# EAGLE design bbSch1 (EAGLE 7.2.0)
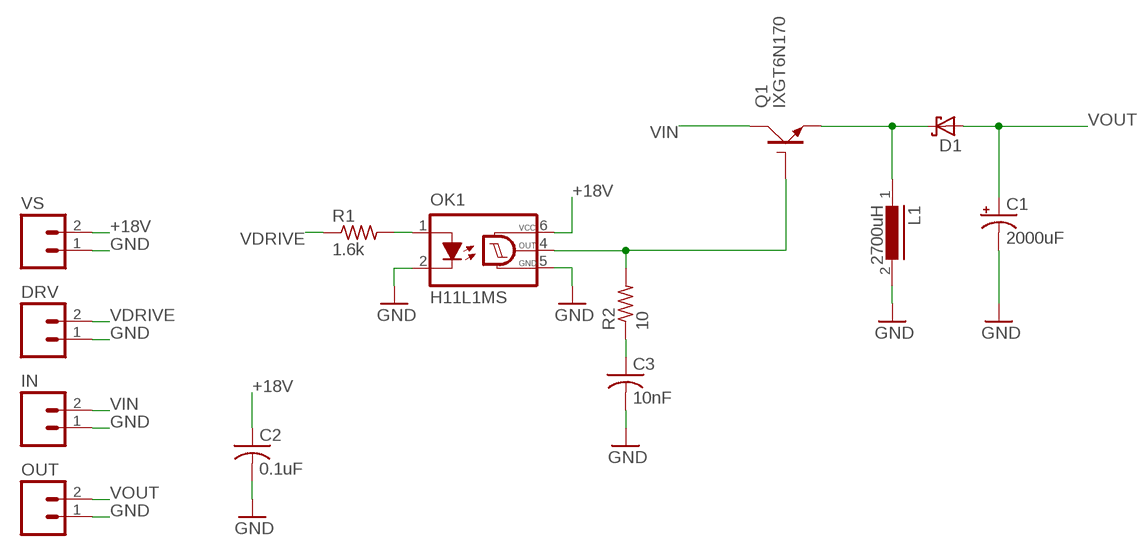
[diagram p0: schematic, sheet 1]

## Parts
C1  2000uF  CAP_POLPTH3  [CPOL-RADIAL-1000UF-63V]
C2  0.1uF  C-USC0805K  [C0805K]
C3  10nF  C-USC0805K  [C0805K]
D1  SCHOTTKY-DIODEC4111-15  [C4111-15]
DRV  M02JST-PTH-VERT  [JST-2-PTH-VERT]
IN  M02JST-PTH-VERT  [JST-2-PTH-VERT]
L1  2700uH  RKE10  [RKE10]
OK1  H11L1MS  [DIL6-SMD]
OUT  M02JST-PTH-VERT  [JST-2-PTH-VERT]
Q1  IXGT6N170  [TO268]
R1  1.6k  R-US_R0805  [R0805]
R2  10  R-US_R0805  [R0805]
VS  M02JST-PTH-VERT  [JST-2-PTH-VERT]

## Nets
+18V [MainPower]: C2.1 OK1.6(VCC) VS.2
GND [Ground]: C1.2(-) C2.2 C3.2 DRV.1 IN.1 L1.2 OK1.2(C) OK1.5(GND) OUT.1 VS.1
N$1: OK1.1(A) R1.2
N$2 [MainPower]: D1.C L1.1 Q1.E
N$4: C3.1 R2.1
VDRIVE: DRV.2 R1.1
VDRIVE18: OK1.4(OUT) Q1.G R2.2
VIN [MainPower]: IN.2 Q1.C@1(C) Q1.C@2(C)
VOUT [MainPower]: C1.1(+) D1.A OUT.2

## Library data of the parts
C1 = SparkFun-Passives:CAP_POL: Capacitor Polarized These are standard SMD and PTH capacitors. Normally 10uF, 47uF, and 100uF in electrolytic and tantalum varieties. Always verify the external diameter of the through hole cap, it varies with capacity, voltage, and manufacturer. The EIA devices should be standard.
C2 C3 = adafruit:C-US: CAPACITOR, American symbol
D1 = diodeMod:SCHOTTKY-DIODE: Schottky Diode
DRV IN OUT VS = SparkFun-Connectors:M02: Standard 2-pin 0.1" header. Use with - straight break away headers ( PRT-00116) - right angle break away headers (PRT-00553) - swiss pins (PRT-00743) - machine pins (PRT-00117) - female headers (PRT-00115) Molex polarized connector foot print use with: PRT-08233 with associated crimp pins and housings. 2.54_SCREWTERM for use with PRT-10571. 3.5mm Screw Terminal footprints for PRT-08084 5mm Screw Terminal footprints for use with PRT-08432
L1 = inductors:RKE10: INDUCTOR
OK1 = optocoupler:H11L*M: 6-Pin DIP Optocoupler Source: http://www.fairchildsemi.com/ds/H1/H11L2-M.pdf; OC_FARNELL: unknown; OC_NEWARK: unknown
Q1 = transistor-power:IXG?*N170: High Voltage IGBT Source: http://www.ixys.com/98989.pdf
R1 R2 = adafruit:R-US_: RESISTOR, American symbol

## Net classes
1 MainPower: width 2.6 mm, drill 0.4 mm
2 Ground: width 2.6 mm, drill 0.4 mm

## Board
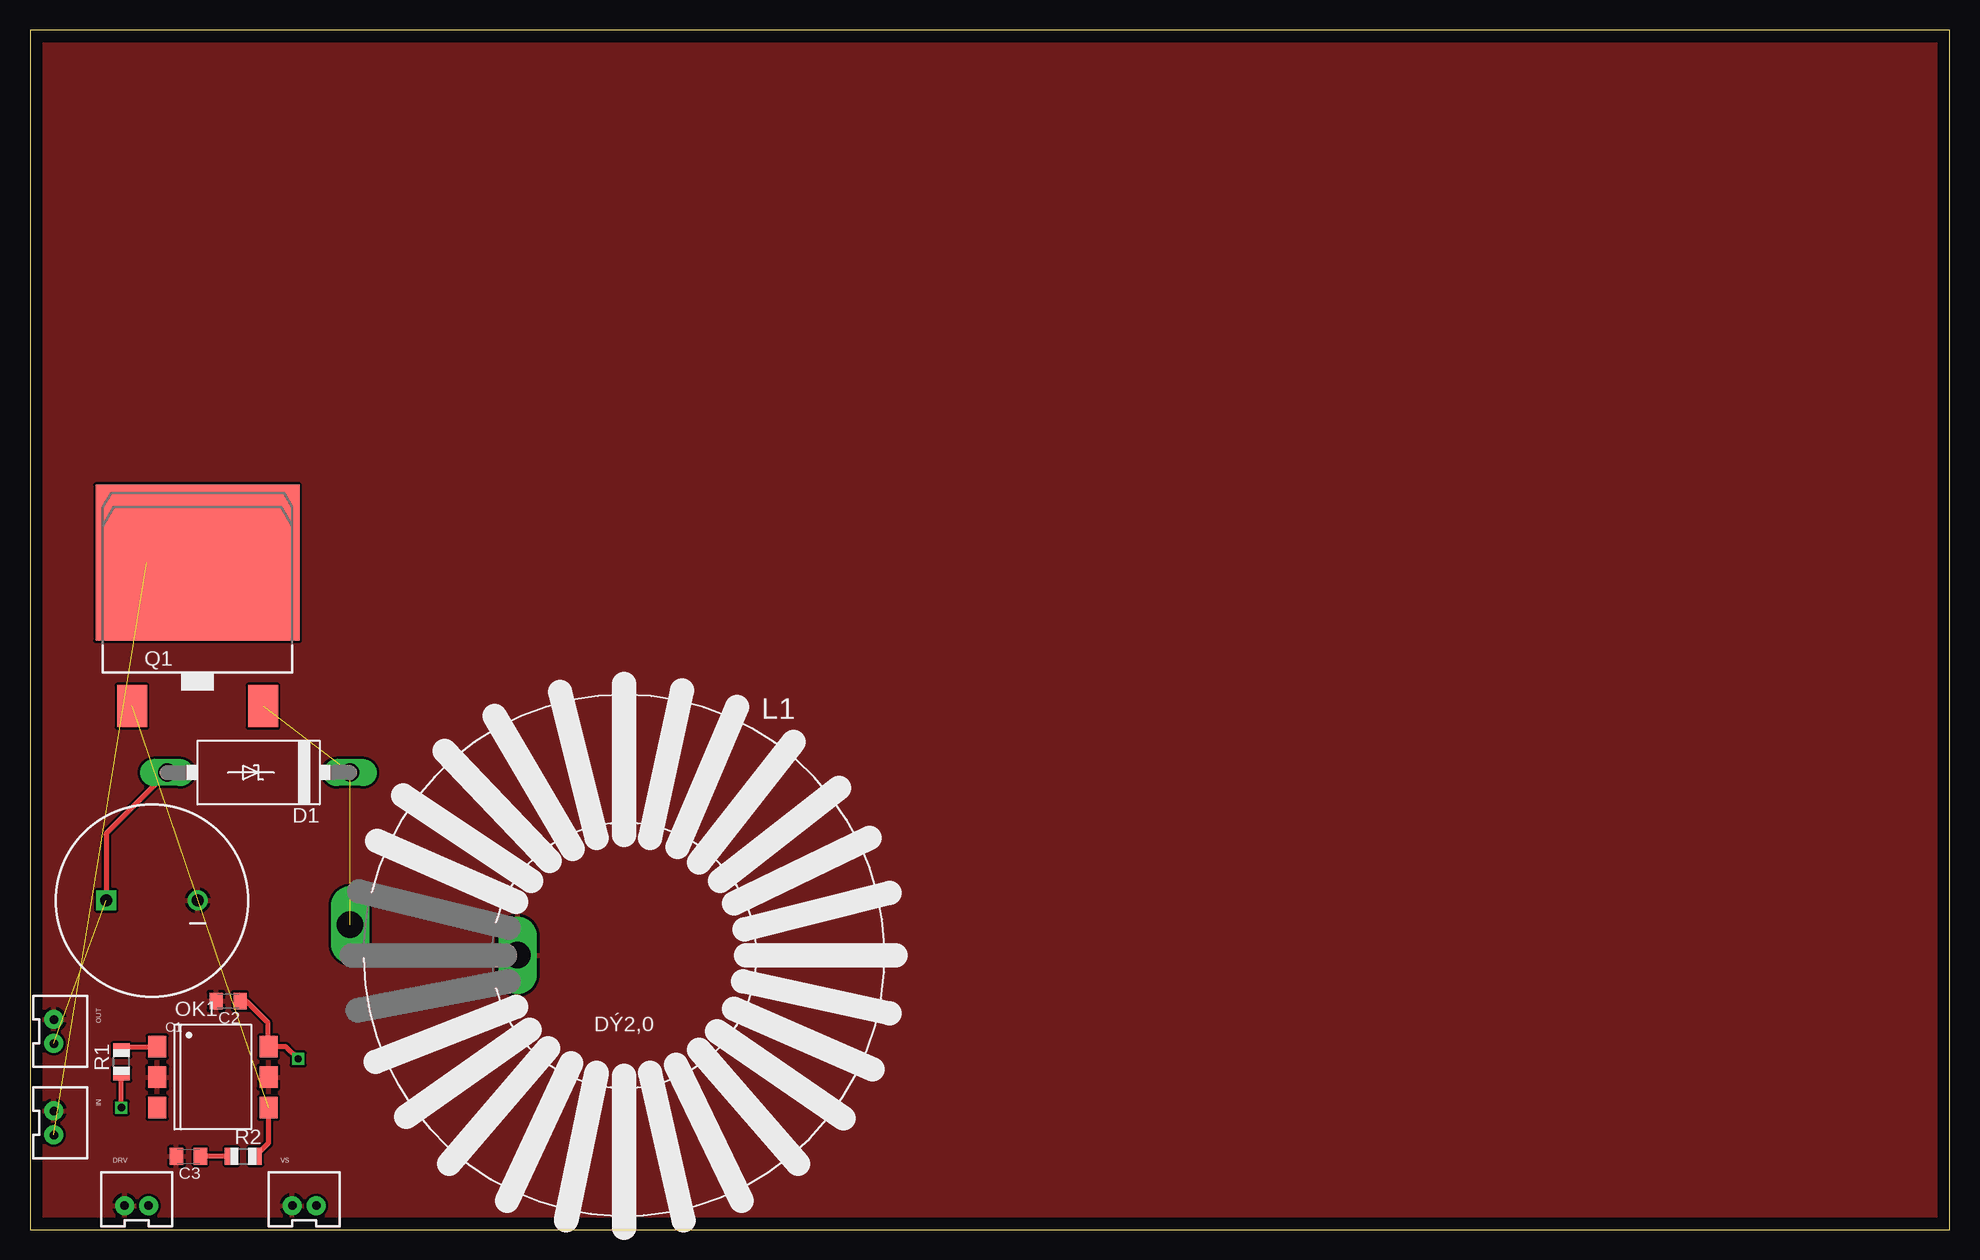
[diagram p1: board, top side]
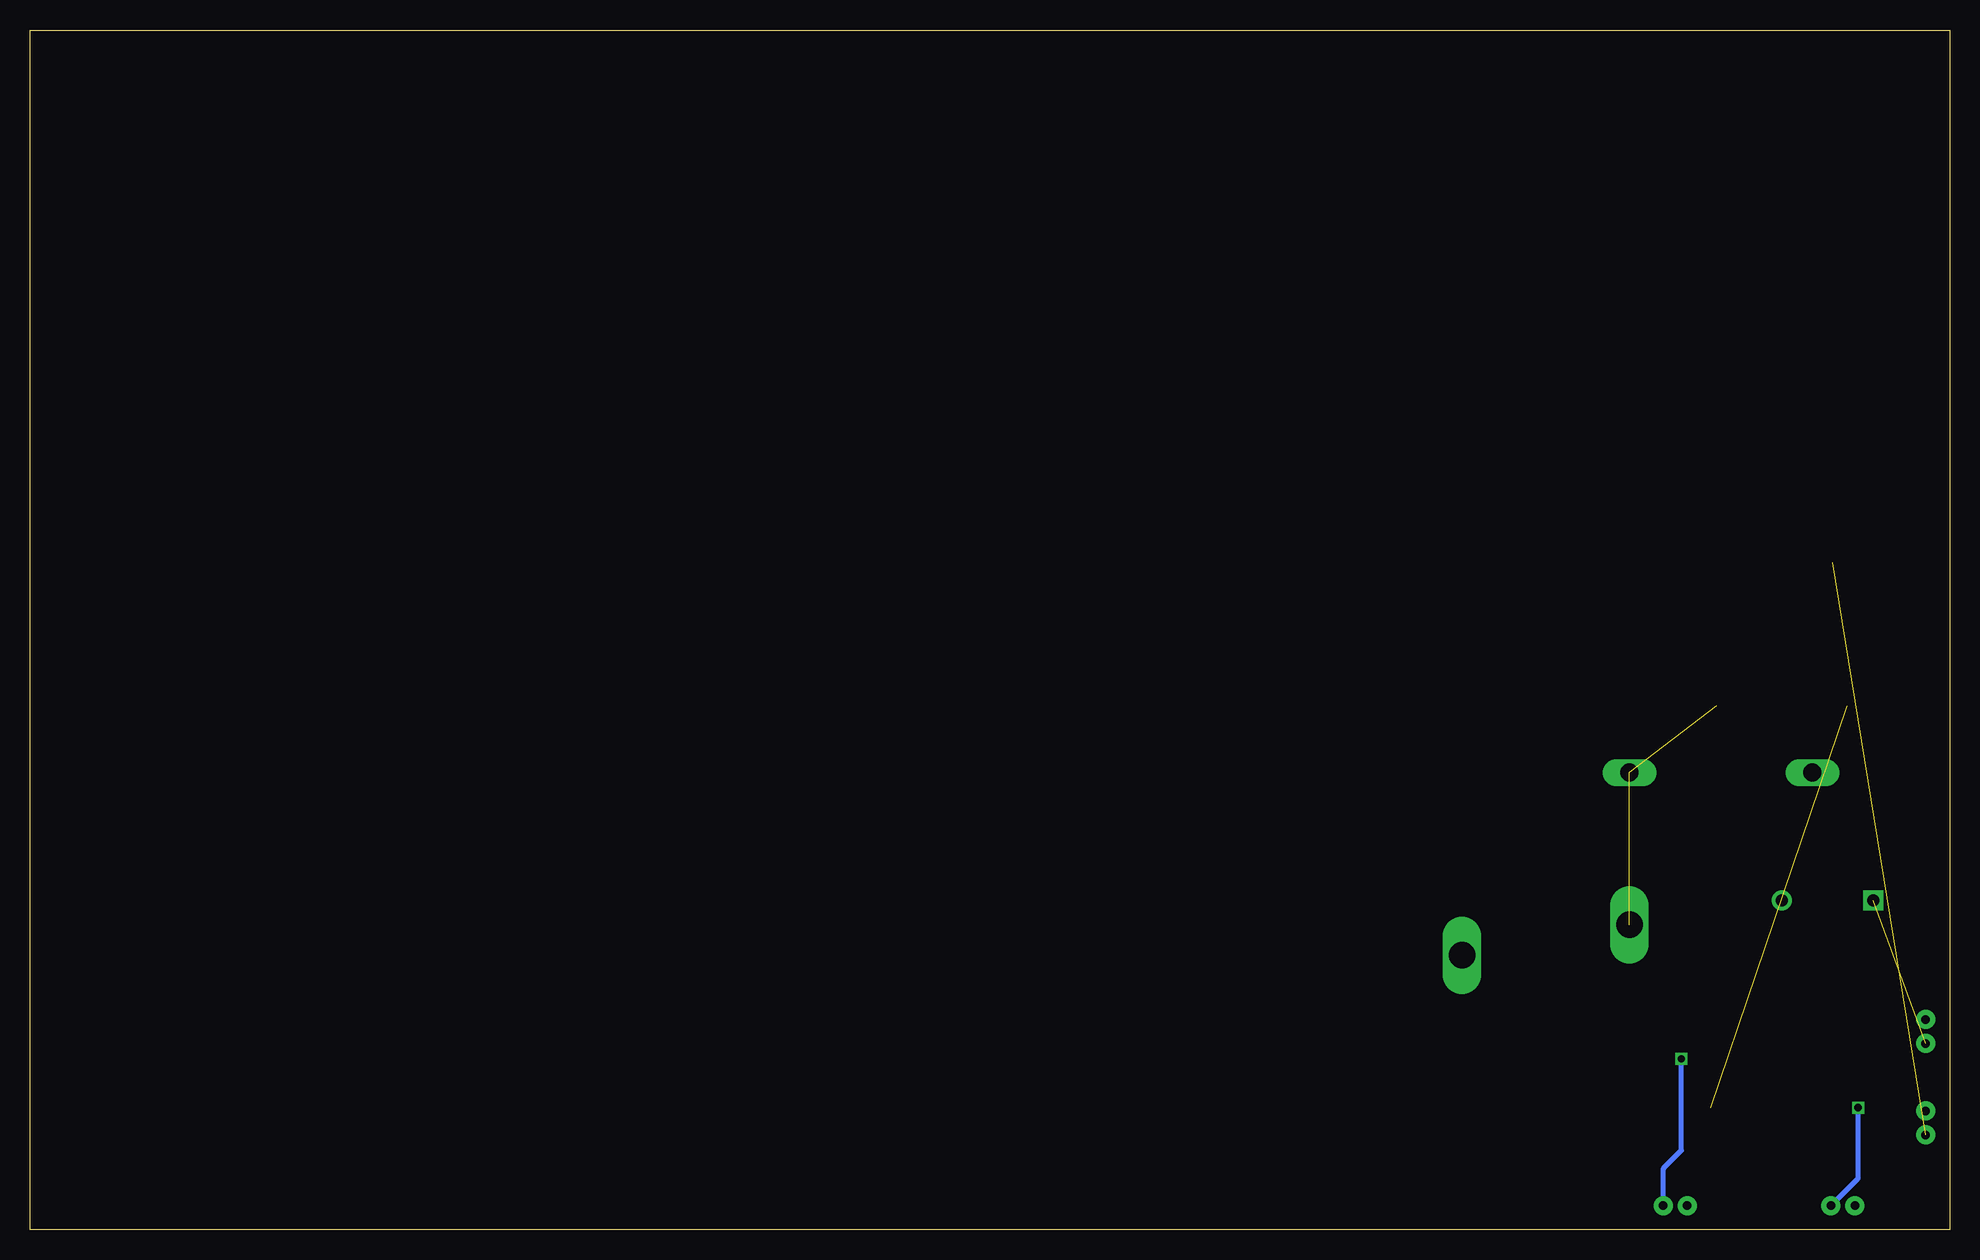
[diagram p2: board, bottom side, seen from below]

Size 160 x 100 mm. Coordinates in mm from the lower left corner, seen from the top.
Outline: 0,0 160,0 160,100 0,100 0,0
Copper layers (1*16): Top 0.035mm / dielectric 1.5mm / Bottom 0.035mm
Design rules "default": minimum track width 10mil, minimum drill 24mil, track to track 8mil, track to pad 8mil, pad to pad 8mil, via to via 8mil, smd to smd 8mil, copper to edge 40mil, drill to drill 8mil, minimum pad ring 10mil, minimum via ring 8mil, stop-mask expansion 4mil, vias tented up to drill 0mil, thermal gap 10mil

### Footprints (pad centres in the part's own frame; a part is rotated, then mirrored left to right if it is on the bottom)
CPOL-RADIAL-1000UF-63V = drill 1.016 pad 1.651 square: 1 3.81,0 | drill 1.016 pad 1.676: 2 -3.81,0
C0805K = smd 1.1 x 1.4: 1 -1,0; 2 1,0
C4111-15 = drill 1.499 long: A 7.62,0; C -7.62,0
JST-2-PTH-VERT = drill 0.7 pad 1.6: 1 -1,-0.55; 2 1,-0.55
RKE10 = drill 2.21 long: 1 -22.86,2.54; 2 -8.89,0
DIL6-SMD = smd 1.78 x 1.52: 1 -2.54,-4.645; 2 0,-4.645; 3 2.54,-4.645; 4 2.54,4.645; 5 0,4.645; 6 -2.54,4.645
TO268 = smd 8.5 x 13: C@1 -4.25,2.25; C@2 4.25,2.25 | smd 2.5 x 3.5: E 5.45,-9.7; G -5.45,-9.7
R0805 = smd 1.1 x 1.4: 1 -1,0; 2 1,0

### Placement (x,y rotation side)
C1  10.16,27.43 180 top
C2  16.51,19.05 180 top
C3  13.21,6.1 180 top
D1  19.05,38.1 180 top
DRV  8.89,2.54 0 top
IN  2.54,8.89 270 top
L1  49.53,22.86 0 top
OK1  15.24,12.7 270 top
OUT  2.54,16.51 270 top
Q1  13.97,53.34 0 top
R1  7.62,13.97 90 top
R2  17.78,6.1 0 top
VS  22.86,2.54 0 top

### Tracks (layer width: path | path; a pad name or v marks a point on that pad's centre or on a via)
+18V  (via drill 0.6)
  Top 0.406: C2.1 17.93,19.05 arc-45 18.11,18.98 19.81,17.27 19.81,15.42 arc45 OK1.6 21.23,15.24 arc-45 21.41,15.17 v22.35,14.22
  Bottom 0.406: VS.2 23.86,4.99 arc45 23.79,5.17 22.35,6.6 v22.35,14.22
GND
  pour Top: -1.27,-1.27 161.29,-1.27 161.29,101.6 -1.27,101.6
N$1
  Top 0.406: R1.2 7.82,15.17 arc-45 8,15.24 OK1.1
N$2  (2 unrouted)
N$4
  Top 0.406: R2.1 C3.1
VDRIVE  (via drill 0.6)
  Top 0.406: v7.62,10.16 R1.1
  Bottom 0.406: DRV.2 7.69,4.19 arc-45 7.62,4.37 v7.62,10.16
VDRIVE18  (1 unrouted)
  Top 0.406: R2.2 19.81,7.13 arc45 19.89,7.31 OK1.4
VIN  (1 unrouted)
VOUT  (1 unrouted)
  Top 0.406: D1.A 6.42,33.09 arc45 6.35,32.91 C1.1